# EAGLE design tinyha_pbx (EAGLE 7.7.0)
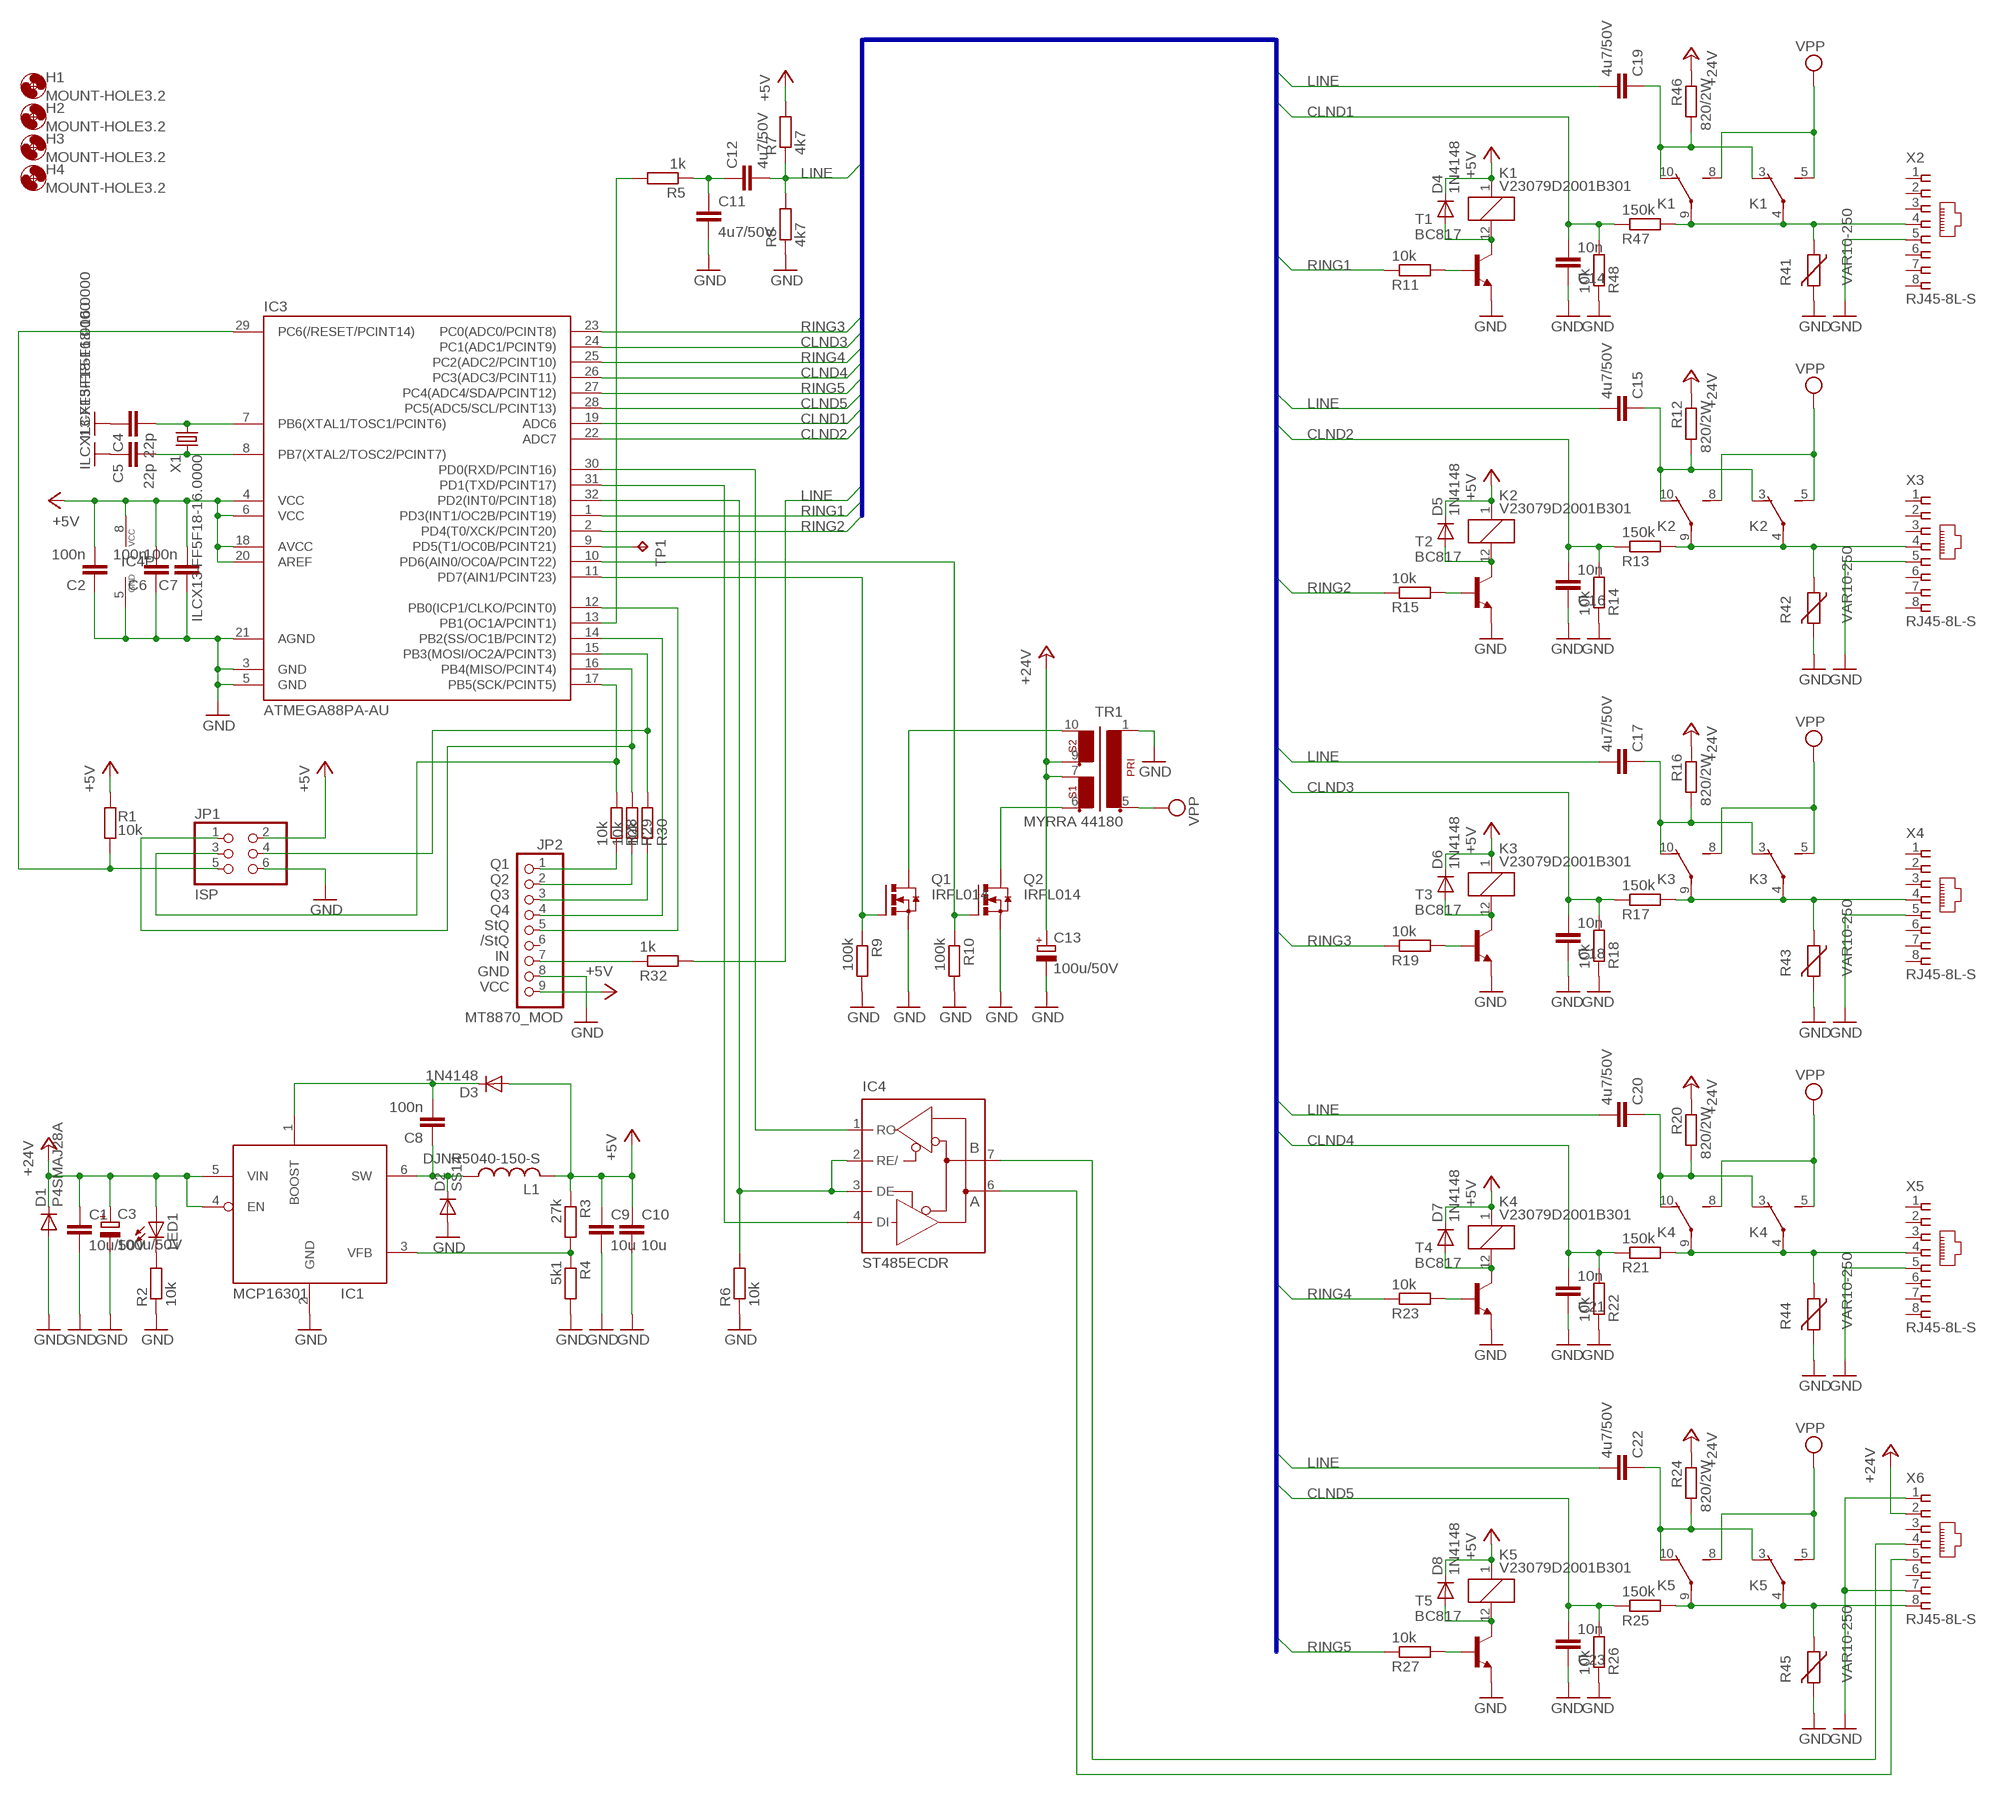
[diagram p0: schematic, sheet 1]

## Parts
C1  10u/50V  C-EUC1210K  [C1210K]
C2  100n  C-EUC1206K  [C1206K]
C3  100u/50V  CPOL-EUE3.5-8  [E3,5-8]
C4  22p  C-EUC0805K  [C0805K]
C5  22p  C-EUC0805K  [C0805K]
C6  100n  C-EUC0805K  [C0805K]
C7  100n  C-EUC0805K  [C0805K]
C8  100n  C-EUC0805K  [C0805K]
C9  10u  C-EUC0805K  [C0805K]
C10  10u  C-EUC0805K  [C0805K]
C11  4u7/50V  C-EUC1206  [C1206]
C12  4u7/50V  C-EUC1206  [C1206]
C13  100u/50V  CPOL-EUE3.5-8  [E3,5-8]
C14  10n  C-EUC1206  [C1206]
C15  4u7/50V  C-EUC1206  [C1206]
C16  10n  C-EUC1206  [C1206]
C17  4u7/50V  C-EUC1206  [C1206]
C18  10n  C-EUC1206  [C1206]
C19  4u7/50V  C-EUC1206  [C1206]
C20  4u7/50V  C-EUC1206  [C1206]
C21  10n  C-EUC1206  [C1206]
C22  4u7/50V  C-EUC1206  [C1206]
C23  10n  C-EUC1206  [C1206]
D1  P4SMAJ28A  DIODE-DO214AC  [DO214AC]
D2  SS14  DIODE-DO214AC  [DO214AC]
D3  1N4148  DIODE-MICROMELF-W  [MICROMELF-W]
D4  1N4148  DIODE-MINIMELF  [MINIMELF]
D5  1N4148  DIODE-MINIMELF  [MINIMELF]
D6  1N4148  DIODE-MINIMELF  [MINIMELF]
D7  1N4148  DIODE-MINIMELF  [MINIMELF]
D8  1N4148  DIODE-MINIMELF  [MINIMELF]
H1  MOUNT-HOLE3.2  [3,2]
H2  MOUNT-HOLE3.2  [3,2]
H3  MOUNT-HOLE3.2  [3,2]
H4  MOUNT-HOLE3.2  [3,2]
IC1  MCP16301  [SOT23-6L]
IC3  ATMEGA88PA-AU  ATMEGA48/88/168-AU  [TQFP32-08]
IC4  ST485ECDR  MAX481CSA  [SO08]
JP1  ISP  PINHD-2X3  [2X03]
JP2  MT8870_MOD  PINHD-1X9  [1X09]
K1  V23079D2001B301  [V23079D]
K2  V23079D2001B301  [V23079D]
K3  V23079D2001B301  [V23079D]
K4  V23079D2001B301  [V23079D]
K5  V23079D2001B301  [V23079D]
L1  DJNR5040-150-S  DJNR5040  [DJNR5040]
LED1  LED3MM  [LED3MM]
Q1  IRFL014  N-HEXFET-2D_SOT232-IRLL014N  [SOT223]
Q2  IRFL014  N-HEXFET-2D_SOT232-IRLL014N  [SOT223]
R1  10k  R-EU_R0805  [R0805]
R2  10k  R-EU_R1206  [R1206]
R3  27k  R-EU_R0805  [R0805]
R4  5k1  R-EU_R0805  [R0805]
R5  1k  R-EU_R1206  [R1206]
R6  10k  R-EU_R1206  [R1206]
R7  4k7  R-EU_R1206  [R1206]
R8  4k7  R-EU_R1206  [R1206]
R9  100k  R-EU_R1206  [R1206]
R10  100k  R-EU_R1206  [R1206]
R11  10k  R-EU_R1206  [R1206]
R12  820/2W  R-EU_0411/15  [0411/15]
R13  150k  R-EU_R1206  [R1206]
R14  10k  R-EU_R1206  [R1206]
R15  10k  R-EU_R1206  [R1206]
R16  820/2W  R-EU_0411/15  [0411/15]
R17  150k  R-EU_R1206  [R1206]
R18  10k  R-EU_R1206  [R1206]
R19  10k  R-EU_R1206  [R1206]
R20  820/2W  R-EU_0411/15  [0411/15]
R21  150k  R-EU_R1206  [R1206]
R22  10k  R-EU_R1206  [R1206]
R23  10k  R-EU_R1206  [R1206]
R24  820/2W  R-EU_0411/15  [0411/15]
R25  150k  R-EU_R1206  [R1206]
R26  10k  R-EU_R1206  [R1206]
R27  10k  R-EU_R1206  [R1206]
R28  10k  R-EU_R1206  [R1206]
R29  10k  R-EU_R1206  [R1206]
R30  10k  R-EU_R1206  [R1206]
R32  1k  R-EU_R1206  [R1206]
R41  VAR10-250  VARISTOR-7,5  [R-7,5]
R42  VAR10-250  VARISTOR-7,5  [R-7,5]
R43  VAR10-250  VARISTOR-7,5  [R-7,5]
R44  VAR10-250  VARISTOR-7,5  [R-7,5]
R45  VAR10-250  VARISTOR-7,5  [R-7,5]
R46  820/2W  R-EU_0411/15  [0411/15]
R47  150k  R-EU_R1206  [R1206]
R48  10k  R-EU_R1206  [R1206]
T1  BC817  BC817-25-NPN-SOT23-BEC  [SOT23-BEC]
T2  BC817  BC817-25-NPN-SOT23-BEC  [SOT23-BEC]
T3  BC817  BC817-25-NPN-SOT23-BEC  [SOT23-BEC]
T4  BC817  BC817-25-NPN-SOT23-BEC  [SOT23-BEC]
T5  BC817  BC817-25-NPN-SOT23-BEC  [SOT23-BEC]
TP1  TPB2,54  [B2,54]
TR1  MYRRA 44180  EI30-2  [EI30-2]
X1  ILCX13-FF5F18-16.0000  XTAL-3225  [SMD3225]
X2  RJ45-8L-S  [RJ45-NO-SHIELD]
X3  RJ45-8L-S  [RJ45-NO-SHIELD]
X4  RJ45-8L-S  [RJ45-NO-SHIELD]
X5  RJ45-8L-S  [RJ45-NO-SHIELD]
X6  RJ45-8L-S  [RJ45-NO-SHIELD]

## Nets
+5V: C2.2 C6.2 C7.2 C9.1 C10.1 D3.A D4.C D5.C D6.C D7.C D8.C IC3.4(VCC) IC3.6(VCC) IC3.18(AVCC) IC3.20(AREF) IC4.8(VCC) JP1.2 JP2.9 K1.1 K2.1 K3.1 K4.1 K5.1 L1.2 R1.1 R3.1 R7.2
+24V: C1.1 C3.+ C13.+ D1.C IC1.4(EN) IC1.5(VIN) LED1.A R12.1 R16.1 R20.1 R24.1 R46.1 TR1.7 TR1.9 X6.2
CLND1: C14.2 IC3.19(ADC6) R47.1 R48.2
CLND2: C16.2 IC3.22(ADC7) R13.1 R14.2
CLND3: C18.2 IC3.24(PC1(ADC1/PCINT9)) R17.1 R18.2
CLND4: C21.2 IC3.26(PC3(ADC3/PCINT11)) R21.1 R22.2
CLND5: C23.2 IC3.28(PC5(ADC5/SCL/PCINT13)) R25.1 R26.2
DIR: IC3.32(PD2(INT0/PCINT18)) IC4.2(RE/) IC4.3(DE) R6.2
GND: C1.2 C2.1 C3.- C4.1 C5.1 C6.1 C7.1 C9.2 C10.2 C11.2 C13.- C14.1 C16.1 C18.1 C21.1 C23.1 D1.A D2.A IC1.2(GND) IC3.3(GND) IC3.5(GND) IC3.21(AGND) IC4.5(GND) JP1.6 JP2.8 Q1.3(S) Q2.3(S) R2.1 R4.2 R6.1 R8.1 R9.2 R10.2 R14.1 R18.1 R22.1 R26.1 R41.2 R42.2 R43.2 R44.2 R45.2 R48.1 T1.E T2.E T3.E T4.E T5.E TR1.1 X1.2(GND) X1.4(GND) X2.5 X3.5 X4.5 X5.5 X6.1 X6.7
LINE: C12.2 C15.2 C17.2 C19.2 C20.2 C22.2 R7.1 R8.2 R32.2
MISO: IC3.16(PB4(MISO/PCINT4)) JP1.1 R29.2
MOSI: IC3.15(PB3(MOSI/OC2A/PCINT3)) JP1.4 R30.2
N$1: D4.A K1.12 T1.C
N$2: R11.2 T1.B
N$3: JP2.1 R28.1
N$4: C15.1 K2.3(O) K2.10(O) R12.2
N$5: K3.4(P) K3.9(P) R17.2 R43.1 X4.4
N$6: K5.4(P) K5.9(P) R25.2 R45.1 X6.8
N$7: K2.4(P) K2.9(P) R13.2 R42.1 X3.4
N$8: K4.4(P) K4.9(P) R21.2 R44.1 X5.4
N$9: IC3.9(PD5(T1/OC0B/PCINT21)) TP1.TP
N$10: D5.A K2.12 T2.C
N$11: R15.2 T2.B
N$12: C17.1 K3.3(O) K3.10(O) R16.2
N$13: JP2.7 R32.1
N$14: D6.A K3.12 T3.C
N$15: R19.2 T3.B
N$16: C20.1 K4.3(O) K4.10(O) R20.2
N$18: D7.A K4.12 T4.C
N$19: LED1.K(C) R2.2
N$20: R23.2 T4.B
N$21: C22.1 K5.3(O) K5.10(O) R24.2
N$23: D8.A K5.12 T5.C
N$24: R27.2 T5.B
N$26: IC3.12(PB0(ICP1/CLKO/PCINT0)) JP2.5
N$27: IC4.7(B) X6.4
N$28: JP2.2 R29.1
N$29: IC4.6(A) X6.5
N$30: JP2.3 R30.1
N$31: IC3.10(PD6(AIN0/OC0A/PCINT22)) Q2.1(G) R10.1
N$32: C11.1 C12.1 R5.1
N$33: IC3.11(PD7(AIN1/PCINT23)) Q1.1(G) R9.1
N$34: Q2.2(D) Q2.4(D) TR1.6
N$35: Q1.2(D) Q1.4(D) TR1.10
N$36: C4.2 IC3.7(PB6(XTAL1/TOSC1/PCINT6)) X1.1
N$37: IC3.14(PB2(SS/OC1B/PCINT2)) JP2.4
N$38: IC1.3(VFB) R3.2 R4.1
N$39: C8.1 D2.C IC1.6(SW) L1.1
N$40: C8.2 D3.C IC1.1(BOOST)
N$44: C5.2 IC3.8(PB7(XTAL2/TOSC2/PCINT7)) X1.3
N$45: IC3.13(PB1(OC1A/PCINT1)) R5.2
N$47: K1.4(P) K1.9(P) R41.1 R47.2 X2.4
N$48: C19.1 K1.3(O) K1.10(O) R46.2
RESET: IC3.29(PC6(/RESET/PCINT14)) JP1.5 R1.2
RING1: IC3.1(PD3(INT1/OC2B/PCINT19)) R11.1
RING2: IC3.2(PD4(T0/XCK/PCINT20)) R15.1
RING3: IC3.23(PC0(ADC0/PCINT8)) R19.1
RING4: IC3.25(PC2(ADC2/PCINT10)) R23.1
RING5: IC3.27(PC4(ADC4/SDA/PCINT12)) R27.1
RXD: IC3.30(PD0(RXD/PCINT16)) IC4.1(RO)
SCK: IC3.17(PB5(SCK/PCINT5)) JP1.3 R28.2
TXD: IC3.31(PD1(TXD/PCINT17)) IC4.4(DI)
VPP: K1.5(S) K1.8(S) K2.5(S) K2.8(S) K3.5(S) K3.8(S) K4.5(S) K4.8(S) K5.5(S) K5.8(S) TR1.5
Unconnected: JP2.6 X2.1 X2.2 X2.3 X2.6 X2.7 X2.8 X3.1 X3.2 X3.3 X3.6 X3.7 X3.8 X4.1 X4.2 X4.3 X4.6 X4.7 X4.8 X5.1 X5.2 X5.3 X5.6 X5.7 X5.8 X6.3 X6.6

## Buses
RING[1..5],CLND[1..5],LINE

## Notes on the sheet
- Q1
- Q2
- Q3
- Q4
- StQ
- /StQ
- IN
- GND
- VCC

## Library data of the parts
C1 C2 C4-C12 C14-C23 = rcl:C-EU: CAPACITOR, European symbol
C3 C13 = rcl:CPOL-EU: POLARIZED CAPACITOR, European symbol
D1-D8 = diode:DIODE-: DIODE
H1-H4 = holes:MOUNT-HOLE: MOUNTING HOLE with drill center marker
IC1 = custom:MCP16301
IC3 = atmega8:ATMEGA48/88/168
IC4 = maxim:MAX481CSA: RS485 TRANSEIVER; MF: MAXIM; MPN: MAX481CSA; OC_FARNELL: unknown; OC_NEWARK: 90C3817
JP1 = pinhead:PINHD-2X3: PIN HEADER
JP2 = pinhead:PINHD-1X9: PIN HEADER
K1-K5 = custom:V23079
L1 = custom:DJNR5040
LED1 = led:LED: LED OSRAM: - CHIPLED LG R971, LG N971, LY N971, LG Q971, LY Q971, LO R971, LY R971 LH N974, LH R974 LS Q976, LO Q976, LY Q976 LO Q996 - Hyper CHIPLED LW Q18S LB Q993, LB Q99A, LB R99A - SideLED LS A670, LO A670, LY A670, LG A670, LP A670 LB A673, LV A673, LT A673, LW A673 LH A674 LY A675 LS A676, LA A676, LO A676, LY A676, LW A676 LS A679, LY A679, LG A679 - Hyper Micro SIDELED® LS Y876, LA Y876, LO Y876, LY Y876 LT Y87S - SmartLED LW L88C, LW L88S LB L89C, LB L89S, LG L890 LS L89K, LO L89K, LY L89K LS L896, LA L896, LO L896, LY L896 - TOPLED LS T670, LO T670, LY T670, LG T670, LP T670 LSG T670, LSP T670, LSY T670, LOP T670, LYG T670 LG T671, LOG T671, LSG T671 LB T673, LV T673, LT T673, LW T673 LH T674 LS T676, LA T676, LO T676, LY T676, LB T676, LH T676, LSB T676, LW T676 LB T67C, LV T67C, LT T67C, LS T67K, LO T67K, LY T67K, LW E67C LS E67B, LA E67B, LO E67B, LY E67B, LB E67C, LV E67C, LT E67C LW T67C LS T679, LY T679, LG T679 LS T770, LO T770, LY T770, LG T770, LP T770 LB T773, LV T773, LT T773, LW T773 LH T774 LS E675, LA E675, LY E675, LS T675 LS T776, LA T776, LO T776, LY T776, LB T776 LHGB T686 LT T68C, LB T68C - Hyper Mini TOPLED® LB M676 - Mini TOPLED Santana® LG M470 LS M47K, LO M47K, LY M47K Source: http://www.osram.convergy.de LUXEON: - LUMILED® LXK2-PW12-R00, LXK2-PW12-S00, LXK2-PW14-U00, LXK2-PW14-V00 LXK2-PM12-R00, LXK2-PM12-S00, LXK2-PM14-U00 LXK2-PE12-Q00, LXK2-PE12-R00, LXK2-PE12-S00, LXK2-PE14-T00, LXK2-PE14-U00 LXK2-PB12-K00, LXK2-PB12-L00, LXK2-PB12-M00, LXK2-PB14-N00, LXK2-PB14-P00, LXK2-PB14-Q00 LXK2-PR12-L00, LXK2-PR12-M00, LXK2-PR14-Q00, LXK2-PR14-R00 LXK2-PD12-Q00, LXK2-PD12-R00, LXK2-PD12-S00 LXK2-PH12-R00, LXK2-PH12-S00 LXK2-PL12-P00, LXK2-PL12-Q00, LXK2-PL12-R00 Source: www.luxeon.com KINGBRIGHT: KA-3528ASYC Source: www.kingbright.com
Q1 Q2 = transistor-power:N-HEXFET-2D_?-*: HEXFET® Power MOSFET 2 Drain connects http://www.irf.com/product-info/datasheets/data/irll014n.pdf
R1-R30 R32 R46-R48 = rcl:R-EU_: RESISTOR, European symbol
R41-R45 = varistor:VARISTOR: VARISTOR
T1-T5 = transistor:*-NPN-: NPN Transistror BF959 corrected 2008.03.06
TP1 = testpad:TP: Test pad
TR1 = trafo:EI30-2: TRANSFORMER 1 primary winding, 2 secondary windings ERA
X1 = custom:XTAL-3225
X2-X6 = con-tycoelectronics:RJ45: CORCOM Modular RJ Jacks No Shield Source: www.tycoelectronics.com .. ENG_DS_1654001_1099_RJ_L_0507.pdf; MF: TYCO ELECTRONICS; MPN: RJ45-8L-S; OC_FARNELL: unknown; OC_NEWARK: 80K9067

## Board
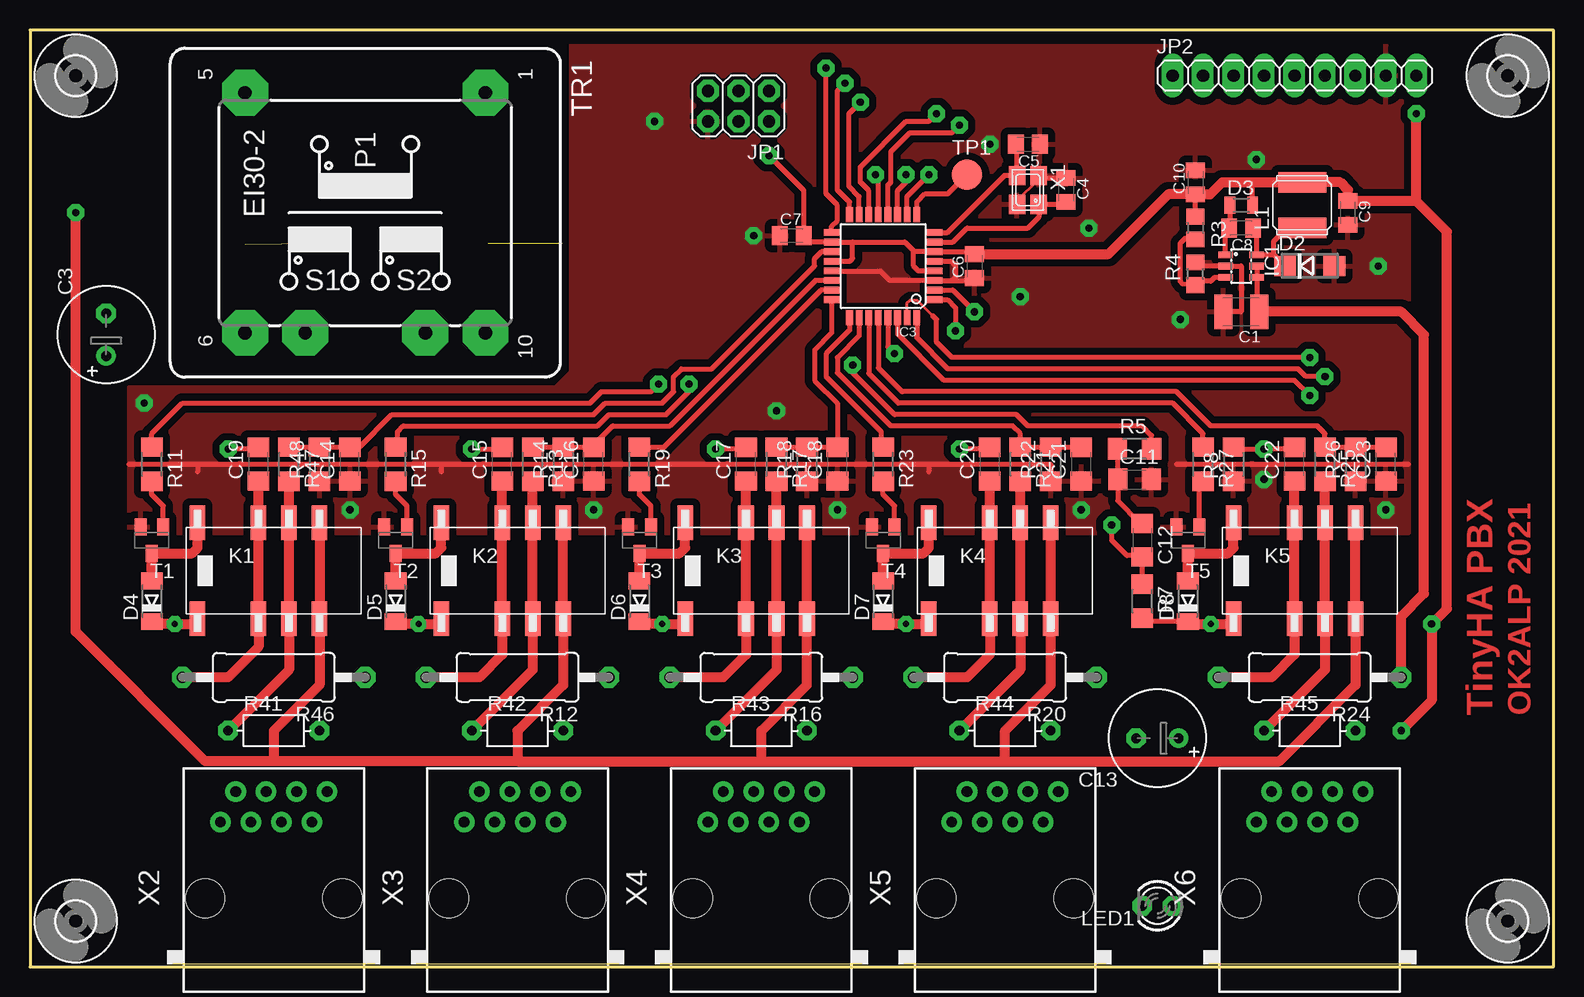
[diagram p1: board, top side]
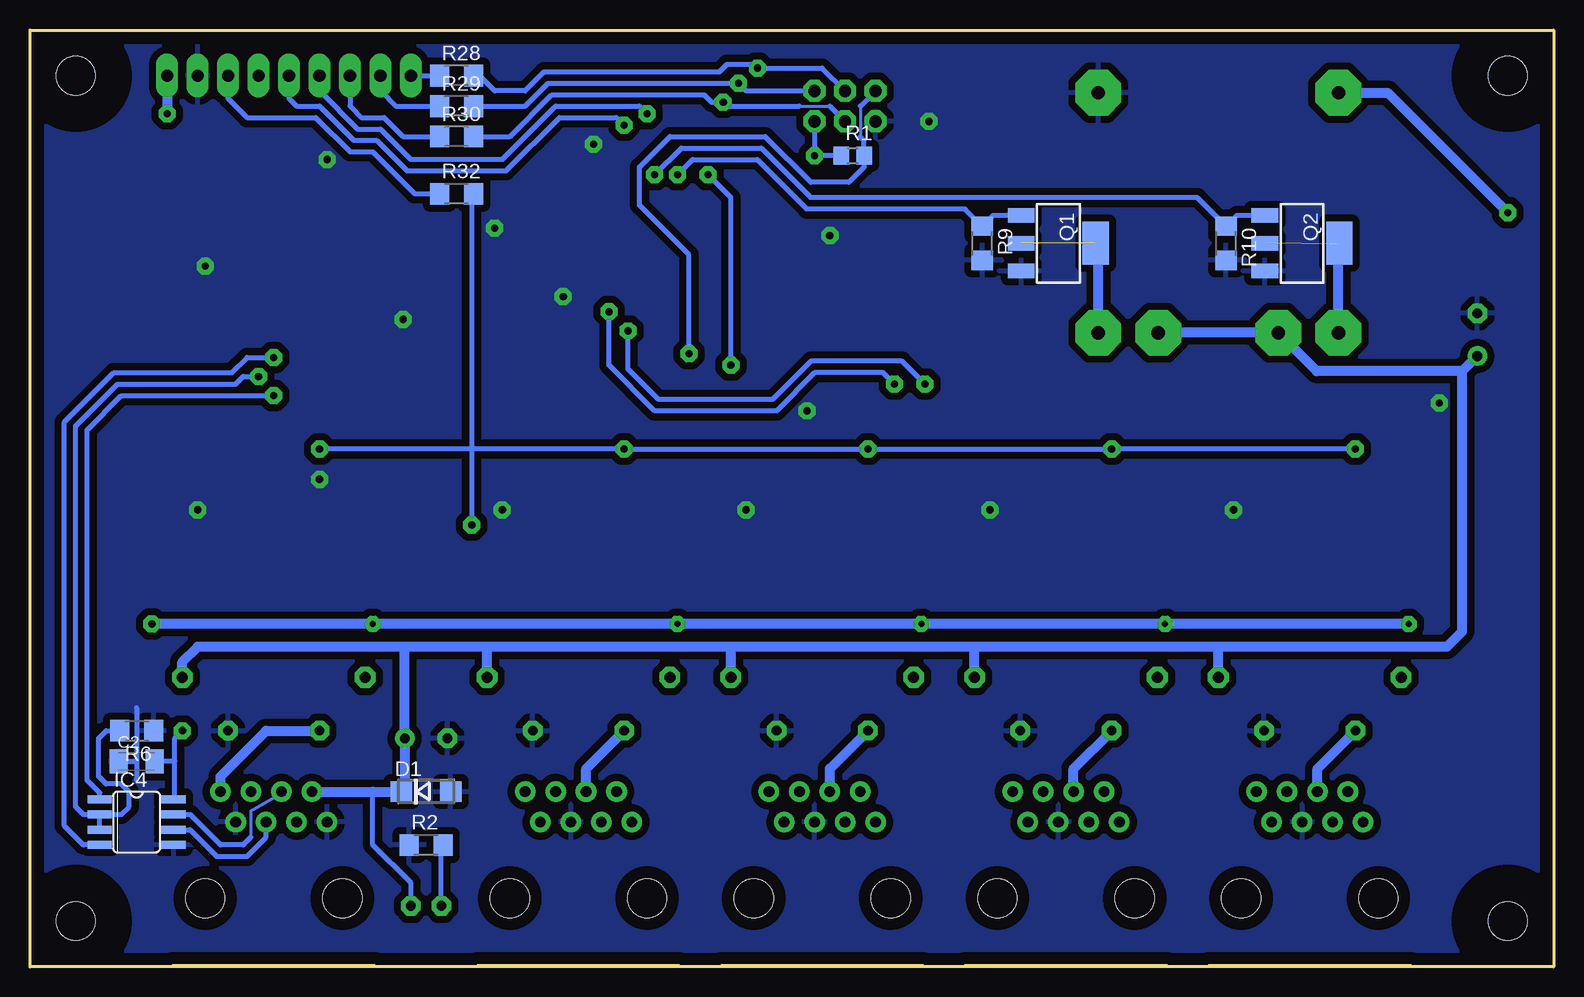
[diagram p2: board, bottom side, seen from below]

Size 127 x 78.11 mm. Coordinates in mm from the lower left corner, seen from the top.
Outline: 0,0 127,0 127,78.11 0,78.11 0,0
Copper layers (1*16): Top 0.035mm / dielectric 1.5mm / Bottom 0.035mm
Design rules "default *": minimum track width 10mil, minimum drill 0.5mm, track to track 8mil, track to pad 8mil, pad to pad 8mil, via to via 8mil, smd to smd 8mil, copper to edge 40mil, drill to drill 8mil, minimum pad ring 16mil, minimum via ring 16mil, stop-mask expansion 4mil, vias tented up to drill 0mil, thermal gap 24mil

### Footprints (pad centres in the part's own frame; a part is rotated, then mirrored left to right if it is on the bottom)
C1210K = smd 1.5 x 2.9: 1 -1.5,0; 2 1.5,0
C1206K = smd 1.5 x 2: 1 -1.5,0; 2 1.5,0
E3,5-8 = drill 0.813 pad 1.6: + -1.778,0 | drill 0.813 pad 1.6 octagon: - 1.778,0
C0805K = smd 1.3 x 1.6: 1 -1,0; 2 1,0
C1206 = smd 1.6 x 1.8: 1 -1.4,0; 2 1.4,0
DO214AC = smd 1.8 x 1.7: A 2.05,0; C -2.05,0
MICROMELF-W = smd 0.9 x 1.4: A 0.95,0; C -0.95,0
MINIMELF = smd 1.4 x 1.8: A 1.7,0; C -1.7,0
3,2 = hole 3.2: 0,0
SOT23-6L = smd 0.55 x 1.2: 1 -0.95,-1.3; 2 0,-1.3; 3 0.95,-1.3; 4 0.95,1.3; 5 0,1.3; 6 -0.95,1.3
TQFP32-08 = smd 1.27 x 0.559: 1 -4.293,2.8; 2 -4.293,2; 3 -4.293,1.2; 4 -4.293,0.4; 5 -4.293,-0.4; 6 -4.293,-1.2; 7 -4.293,-2; 8 -4.293,-2.8; 17 4.293,-2.8; 18 4.293,-2; 19 4.293,-1.2; 20 4.293,-0.4; 21 4.293,0.4; 22 4.293,1.2; 23 4.293,2; 24 4.293,2.8 | smd 0.559 x 1.27: 9 -2.8,-4.293; 10 -2,-4.293; 11 -1.2,-4.293; 12 -0.4,-4.293; 13 0.4,-4.293; 14 1.2,-4.293; 15 2,-4.293; 16 2.8,-4.293; 25 2.8,4.293; 26 2,4.293; 27 1.2,4.293; 28 0.4,4.293; 29 -0.4,4.293; 30 -1.2,4.293; 31 -2,4.293; 32 -2.8,4.293
SO08 = smd 0.66 x 2.032: 1 -1.905,-3.073; 2 -0.635,-3.073; 3 0.635,-3.073; 4 1.905,-3.073; 5 1.905,3.073; 6 0.635,3.073; 7 -0.635,3.073; 8 -1.905,3.073
2X03 = drill 1.016 octagon: 1 -2.54,-1.27; 2 -2.54,1.27; 3 0,-1.27; 4 0,1.27; 5 2.54,-1.27; 6 2.54,1.27
1X09 = drill 1.016 long: 1 -10.16,0; 2 -7.62,0; 3 -5.08,0; 4 -2.54,0; 5 0,0; 6 2.54,0; 7 5.08,0; 8 7.62,0; 9 10.16,0
V23079D = smd 1.3 x 2.85: 1 -6.35,-4; 3 -1.27,-4; 4 1.27,-4; 5 3.81,-4; 8 3.81,4; 9 1.27,4; 10 -1.27,4; 12 -6.35,4
DJNR5040 = smd 1.7 x 4: 1 -1.9,0; 2 1.9,0
LED3MM = drill 0.813 octagon: A -1.27,0; K 1.27,0
SOT223 = smd 1.219 x 2.235: 1 -2.311,-3.099; 2 0,-3.099; 3 2.311,-3.099 | smd 3.6 x 2.2: 4 0,3.099
R0805 = smd 1.3 x 1.5: 1 -0.95,0; 2 0.95,0
R1206 = smd 1.6 x 1.803: 1 -1.422,0; 2 1.422,0
0411/15 = drill 0.914 octagon: 1 -7.62,0; 2 7.62,0
R-7,5 = drill 0.813 octagon: 1 -3.81,0; 2 3.81,0
SOT23-BEC = smd 1 x 1.4: B -0.95,-1.1; C 0,1.1; E 0.95,-1.1
B2,54 = smd 2.54 x 2.54: TP 0,0
EI30-2 = drill 1.118 pad 3.81 octagon: 1 -10.008,10.008; 5 -10.008,-10.008; 6 10.008,-10.008; 7 10.008,-5.004; 9 10.008,5.004; 10 10.008,10.008
SMD3225 = smd 1.6 x 1.35: 1 1.2,0.9; 2 -1.2,0.9; 3 -1.2,-0.9; 4 1.2,-0.9
RJ45-NO-SHIELD = drill 0.9 pad 1.4: 1 -4.445,6.35; 2 -3.175,8.89; 3 -1.905,6.35; 4 -0.635,8.89; 5 0.635,6.35; 6 1.905,8.89; 7 3.175,6.35; 8 4.445,8.89 | hole 3.251: -5.715,0; 5.715,0

### Placement (x,y rotation side)
C1  100.97,54.61 180 top
C2  118.11,17.14 0 bottom
C3  6.35,52.7 90 top
C4  86.36,64.77 270 top
C5  83.19,68.58 180 top
C6  78.74,58.42 90 top
C7  63.5,60.96 0 top
C8  100.97,61.59 180 top
C9  109.86,62.87 270 top
C10  97.16,65.41 90 top
C11  92.08,40.64 0 top
C12  92.71,35.56 270 top
C13  93.98,19.05 180 top
C14  26.67,41.91 90 top
C15  39.37,41.91 90 top
C16  46.99,41.91 90 top
C17  59.69,41.91 90 top
C18  67.31,41.91 90 top
C19  19.05,41.91 90 top
C20  80.01,41.91 90 top
C21  87.63,41.91 90 top
C22  105.41,41.91 90 top
C23  113.03,41.91 90 top
D1  93.98,14.61 0 bottom
D2  106.68,58.42 0 top
D3  100.97,63.5 0 top
D4  10.16,30.48 90 top
D5  30.48,30.48 90 top
D6  50.8,30.48 90 top
D7  71.12,30.48 90 top
D8  96.52,30.48 90 top
H1  3.81,3.81 0 top
H2  123.19,3.81 0 top
H3  3.81,74.3 0 top
H4  123.19,74.3 0 top
IC1  100.97,58.42 270 top
IC3  71.12,58.42 180 top
IC4  118.11,12.06 270 bottom
JP1  59.05,71.75 180 top
JP2  105.41,74.3 0 top
K1  20.32,33.02 0 top
K2  40.64,33.02 0 top
K3  60.96,33.02 0 top
K4  81.28,33.02 0 top
K5  106.68,33.02 0 top
L1  106.05,63.5 90 top
LED1  93.98,5.08 180 top
Q1  41.27,60.33 270 bottom
Q2  20.95,60.33 270 bottom
R1  58.42,67.63 0 bottom
R2  93.98,10.16 0 bottom
R3  97.16,61.59 270 top
R4  97.16,57.78 90 top
R5  92.08,43.18 0 top
R6  118.11,19.68 180 bottom
R7  92.71,30.48 270 top
R8  100.33,41.91 90 top
R9  47.62,60.33 270 bottom
R10  27.3,60.33 270 bottom
R11  10.16,41.91 270 top
R12  40.64,24.13 180 top
R13  41.91,41.91 270 top
R14  44.45,41.91 90 top
R15  30.48,41.91 270 top
R16  60.96,24.13 180 top
R17  62.23,41.91 270 top
R18  64.77,41.91 90 top
R19  50.8,41.91 270 top
R20  81.28,24.13 180 top
R21  82.55,41.91 270 top
R22  85.09,41.91 90 top
R23  71.12,41.91 270 top
R24  106.68,24.13 180 top
R25  107.95,41.91 270 top
R26  110.49,41.91 90 top
R27  97.79,41.91 270 top
R28  91.44,74.3 0 bottom
R29  91.44,71.75 0 bottom
R30  91.44,69.22 0 bottom
R32  91.44,64.45 0 bottom
R41  20.32,19.68 0 top
R42  40.64,19.68 0 top
R43  60.96,19.68 0 top
R44  81.28,19.68 0 top
R45  106.68,19.68 0 top
R46  20.32,24.13 180 top
R47  21.59,41.91 270 top
R48  24.13,41.91 90 top
T1  10.16,35.56 180 top
T2  30.48,35.56 180 top
T3  50.8,35.56 180 top
T4  71.12,35.56 180 top
T5  96.52,35.56 180 top
TP1  78.11,66.04 0 top
TR1  27.94,62.87 270 top
X1  83.19,64.77 270 top
X2  20.32,5.71 0 top
X3  40.64,5.71 0 top
X4  60.96,5.71 0 top
X5  81.28,5.71 0 top
X6  106.68,5.71 0 top

### Tracks (layer width: path | path; a pad name or v marks a point on that pad's centre or on a via)
+5V  (via drill 0.5, 0.6)
  Top 0.406: D3.A 101.92,65.08 102.23,65.41 | D8.C 92.99,28.78 R7.2 | IC3.4 74.06,58.02 73.66,58.42 73.66,59.69 | 68.58,60.42 IC3.18 65.04,60.42 C7.2 64.5,64.72 v61.59,67.63 | 68.58,60.42 72.93,60.42 73.66,59.69 | 73.66,59.69 73.73,59.62 IC3.6 78.54,59.62 C6.2 | R3.1 C10.1 | IC3.20 68.34,58.82 68.58,59.05 68.58,60.42
  Top 0.813: D8.C 96.52,28.57 v98.42,28.57 99.89,28.57 K5.1 | D7.C 71.33,28.57 v73.03,28.57 74.48,28.57 K4.1 | D6.C 51.01,28.57 v52.7,28.57 54.61,28.57 K3.1 | D5.C 30.68,28.57 v32.38,28.57 33.84,28.57 K2.1 | D4.C 10.37,28.57 v12.06,28.57 13.53,28.57 K1.1 | v114.3,19.68 116.84,22.23 v116.84,28.57 118.11,29.84 118.11,61.28 115.57,63.82 | 115.57,63.82 v115.57,71.12 | C6.2 89.9,59.42 94.89,64.41 C10.1 98.38,64.41 99.38,65.41 102.23,65.41 L1.2 109.22,65.41 109.86,64.77 C9.1 109.9,63.82 115.57,63.82
  Bottom 0.406: 114.94,17.14 C2.2 | IC4.8 114.94,13.97 114.94,17.14 | 114.94,17.14 114.94,19.05 v114.3,19.68 | 61.59,69.22 JP1.2 v61.59,67.63 R1.1
  Bottom 0.813: v12.06,28.57 v32.38,28.57 v52.7,28.57 v73.03,28.57 v98.42,28.57 v116.84,28.57 | JP2.9 v115.57,71.12
+24V
  Top 0.406: IC1.5 IC1.4 102.27,54.98 C1.1
  Top 0.813: R24.1 114.3,29.21 116.2,31.11 116.2,52.7 114.3,54.61 C1.1
  Bottom 0.406: LED1.A 95.25,6.99 98.42,10.16 98.42,14.61
  Bottom 0.813: 27.94,26.67 8.89,26.67 7.62,27.94 7.62,49.66 | 27.94,26.67 48.26,26.67 | 48.26,26.67 68.58,26.67 | 68.58,26.67 88.9,26.67 | TR1.9 TR1.7 19.74,49.66 7.62,49.66 | 88.9,26.67 95.89,26.67 | 95.89,26.67 113.03,26.67 114.3,25.4 R24.1 | R46.1 27.94,26.67 | R12.1 48.26,26.67 | R16.1 68.58,26.67 | R20.1 88.9,26.67 | X6.2 98.42,14.61 D1.C | D1.C 95.89,14.61 | 7.62,49.66 C3.+ | D1.C 95.76,14.88 C13.+ 95.76,26.54 95.89,26.67
CLND1
  Top 0.406: R47.1 R48.2 26.65,43.33 C14.2 27.43,43.31 30.16,46.04 46.99,46.04 47.94,46.99 52.7,46.99 53.66,47.94 53.66,49.21 54.29,49.85 56.83,49.85 65.41,58.42 65.41,59.05 65.97,59.62 IC3.19
CLND2
  Top 0.406: R13.1 R14.2 47.01,43.33 | 47.62,43.18 47.47,43.33 47.01,43.33 | IC3.22 65.47,57.22 53.34,45.09 48.58,45.09 46.99,43.5 C16.2 47.01,43.33
CLND3
  Top 0.406: R17.1 R18.2 67.29,43.33 C18.2 67.31,46.99 65.41,48.9 65.41,51.44 66.83,52.86 IC3.24
CLND4
  Top 0.406: C21.2 87.61,43.33 R22.2 R21.1 82.55,44.45 81.92,45.09 71.75,45.09 67.31,49.53 67.31,50.8 69.12,52.61 IC3.26
CLND5
  Top 0.406: C23.2 113.01,43.33 R26.2 R25.1 107.95,44.45 107.31,45.09 98.42,45.09 95.57,47.94 72.71,47.94 70.72,49.93 IC3.28
DIR  (via drill 0.6)
  Top 0.406: v107.95,49.21 106.36,49.21 105.73,49.85 76.52,49.85 73.92,52.45 IC3.32
  Bottom 0.406: IC4.3 IC4.2 | IC4.2 122.56,12.7 123.19,13.34 123.19,45.09 119.7,48.58 109.86,48.58 109.22,49.21 v107.95,49.21 | IC4.2 119.38,12.7 118.75,13.34 118.75,14.61 119.38,15.24 120.65,15.24 121.28,15.88 121.28,19.05 120.65,19.68 R6.2
GND  (via drill 0.6)
  Top 0.254: X1.4 82.28,63.87 84.08,65.67 X1.2
  Top 0.406: R4.2 97.37,58.42 IC1.2 100.97,58.42 100.97,54.61 C1.2 | IC3.21 70.89,58.02 71.69,57.22 IC3.3 76.83,57.22 | IC3.5 76.75,58.82 77.15,58.42 77.15,57.54 76.83,57.22 | 8.26,41.91 13.97,41.91 | 13.97,41.91 34.29,41.91 | 34.29,41.91 74.93,41.91 | 74.93,41.91 85.09,41.91 85.09,40.64 | 95.57,41.91 114.94,41.91 | 74.93,41.91 74.93,41.27 | 34.29,41.91 34.29,41.27 | 13.97,41.91 13.97,41.27 | C4.1 84.28,65.77 X1.2 | 76.83,57.22 78.54,57.22 C6.1
  Bottom 0.406: 118.11,21.59 118.11,17.14 | 118.11,17.14 118.11,15.56 | C2.1 118.11,17.14
  other vias: 26.67,38.1 46.99,38.1 67.31,38.1 87.63,38.1 102.87,40.64 113.03,38.1 9.53,46.99 112.39,58.42 95.89,53.98 102.23,67.31 80.01,68.58 60.33,60.96 82.55,55.88 62.23,46.35 52.07,70.48 88.27,61.59
  pour Bottom (isolate 0.61): 0,0 127,0 127,78.11 0,78.11
  pour Top (isolate 0.61): 8.26,36.2 114.94,36.2 114.94,78.11 45.09,78.11 45.09,49.53 43.81,48.26 8.26,48.26
LINE  (via drill 0.6)
  Top 0.406: C19.2 19.05,43.18 v16.51,43.18 | v36.83,43.18 39.24,43.18 C15.2 | C17.2 59.69,43.18 v57.15,43.18 | C20.2 80.01,43.18 v77.47,43.18 | C22.2 105.41,43.18 v102.87,43.18 100.33,43.18 R8.2 | R7.1 C12.2 92.71,34.29 91.44,34.29 90.17,35.56 v90.17,36.83
  Bottom 0.406: v16.51,43.18 v36.83,43.18 v57.15,43.18 v77.47,43.18 90.17,43.18 | 90.17,43.18 v90.17,36.83 | 90.17,43.18 v102.87,43.18 | 90.17,43.18 90.17,64.3 R32.2
MISO  (via drill 0.6)
  Top 0.406: IC3.16 68.32,63.76 67.31,64.77 67.31,73.03 v67.94,73.66
  Bottom 0.406: R29.2 85.72,71.75 83.82,73.66 v67.94,73.66 67.31,73.03 JP1.1
MOSI  (via drill 0.6)
  Top 0.406: IC3.15 69.12,64.23 68.26,65.09 68.26,71.12 v69.22,72.07
  Bottom 0.254: 62.87,71.75 60.33,71.75
  Bottom 0.406: R30.2 87,69.22 83.5,72.71 70.8,72.71 70.17,72.07 v69.22,72.07 68.9,71.75 62.87,71.75 | 60.33,71.75 JP1.4
N$1
  Top 0.813: K1.12 13.97,34.92 13.51,34.46 T1.C D4.A
N$2
  Top 0.406: T1.B 11.11,38.42 10.16,39.37 R11.2
N$3
  Bottom 0.406: JP2.1 R28.1
N$4
  Top 0.813: R12.2 37.47,24.13 39.37,26.04 K2.3 K2.10 C15.1
N$5
  Top 0.813: R43.1 62.23,24.77 K3.4 K3.9 R17.2
  Bottom 0.813: X4.4 60.33,16.51 R43.1
N$6
  Top 0.813: R45.1 107.95,24.77 K5.4 K5.9 R25.2
  Bottom 0.813: X6.8 111.12,15.88 107.31,19.68 R45.1
N$7
  Top 0.813: R42.1 41.91,24.77 K2.4 K2.9 R13.2
  Bottom 0.813: X3.4 40.01,16.51 R42.1
N$8
  Top 0.813: R44.1 82.55,24.77 K4.4 K4.9 R21.2
  Bottom 0.813: X5.4 80.64,16.51 R44.1
N$9
  Top 0.406: IC3.9 73.92,63.76 74.61,64.45 76.52,64.45 TP1.TP
N$10
  Top 0.813: D5.A T2.C 33.83,34.46 34.29,34.92 K2.12
N$11
  Top 0.406: T2.B 31.43,38.42 30.48,39.37 R15.2
N$12
  Top 0.813: R16.2 57.78,24.13 59.69,26.04 K3.3 K3.10 C17.1
N$13
  Bottom 0.406: JP2.7 110.49,72.39 108.9,70.8 103.19,70.8 100.33,67.94 98.42,67.94 94.93,64.45 R32.1
N$14
  Top 0.813: D6.A T3.C 54.15,34.46 54.61,34.92 K3.12
N$15
  Top 0.406: T3.B 51.75,38.42 50.8,39.37 R19.2
N$16
  Top 0.813: R20.2 78.11,24.13 80.01,26.04 K4.3 K4.10 C20.1
N$17  (via drill 0.6)
  other vias: 14.61,5.71
N$18
  Top 0.813: K4.12 74.93,34.92 74.47,34.46 T4.C D7.A
N$19
  Bottom 0.406: LED1.K 92.71,10.01 R2.2
N$20
  Top 0.406: T4.B 72.07,38.42 71.12,39.37 R23.2
N$21
  Top 0.813: R24.2 103.5,24.13 105.41,26.04 K5.3 K5.10 C22.1
N$22  (via drill 0.6)
  other vias: 26.04,5.71
N$23
  Top 0.813: K5.12 100.33,34.92 99.86,34.46 T5.C D8.A
N$24
  Top 0.406: T5.B 97.47,40.17 R27.2
N$25  (via drill 0.6)
  other vias: 34.92,5.71
N$26  (via drill 0.6)
  Top 0.406: IC3.12 71.52,65.17 71.75,65.41 71.75,67.94 73.34,69.53 76.83,69.53 v77.47,70.17
  Bottom 0.406: JP2.5 105.41,72.39 104.78,71.75 102.87,71.75 100.01,68.9 98.11,68.9 95.57,66.36 87.31,66.36 82.87,70.8 78.11,70.8 v77.47,70.17
N$27
  Bottom 0.254: 108.58,10.79 108.58,13.02 106.36,14.29 X6.4
  Bottom 0.406: 108.58,10.79 109.22,10.16 111.12,10.16 113.67,12.7 IC4.7
N$28
  Bottom 0.406: JP2.2 97.79,73.03 96.52,71.75 R29.1
N$29
  Bottom 0.406: IC4.6 113.67,11.43 111.44,9.21 108.9,9.21 107.31,10.79 X6.5
N$30
  Bottom 0.406: JP2.3 100.33,71.75 99.38,70.8 97.47,70.8 95.89,69.22 R30.1
N$31  (via drill 0.6)
  Top 0.406: IC3.10 73.12,64.23 v74.93,66.04
  Bottom 0.406: Q2.1 26.42,62.64 R10.1 | R10.1 27.46,61.75 | v74.93,66.04 72.71,68.26 66.04,68.26 61.91,64.14 29.69,64.14 R10.1
N$32
  Top 0.406: R5.1 90.67,43.16 C11.1 90.67,38.87 92.58,36.96 C12.1
N$33  (via drill 0.6)
  Top 0.406: IC3.11 72.32,64.7 73.03,65.41 v73.03,66.04
  Bottom 0.406: Q1.1 46.74,62.64 R9.1 49.06,63.18 62.23,63.18 66.36,67.31 71.75,67.31 v73.03,66.04
N$34  (1 unrouted)
  Bottom 0.813: TR1.6 17.93,60.25 Q2.4
N$35  (1 unrouted)
  Bottom 0.813: TR1.10 37.95,60.1 Q1.4
N$36
  Top 0.406: C4.2 86.16,63.57 X1.1 84.08,62.49 83.19,61.59 78.11,61.59 76.93,60.42 IC3.7
N$37  (via drill 0.6)
  Top 0.406: IC3.14 69.92,64.7 69.22,65.41 69.22,66.67 73.03,70.48 74.93,70.48 v75.56,71.12
  Bottom 0.406: JP2.4 102.87,73.03 99.69,69.85 97.79,69.85 95.25,67.31 87.63,67.31 83.19,71.75 76.2,71.75 v75.56,71.12
N$38
  Top 0.406: IC1.3 98.75,57.47 98.42,57.15 97.37,57.15 R4.1 96.1,56.94 95.89,57.15 95.89,60.33 96.31,60.74 R3.2
N$39
  Top 0.406: C8.1 102.27,61.3 IC1.6 103.68,59.37 | 103.68,59.37 D2.C | 103.68,59.37 103.68,60.5 104.78,61.59 L1.1
N$40
  Top 0.406: IC1.1 99.67,61.3 C8.2 100.02,61.65 D3.C
N$41  (via drill 0.6)
  other vias: 46.35,5.71
N$42  (via drill 0.6)
  other vias: 55.24,5.71
N$43  (via drill 0.6)
  other vias: 66.67,5.71
N$44
  Top 0.406: C5.2 82.28,68.48 X1.3 81.21,65.97 76.46,61.22 IC3.8
N$45  (via drill 0.6)
  Top 0.406: R5.2 93.5,44.3 92.71,45.09 83.19,45.09 82.23,46.04 72.07,46.04 68.58,49.53 v68.58,50.16 | IC3.13 70.72,65.81 v70.48,66.04
  Bottom 0.406: v68.58,50.16 68.58,64.14 v70.48,66.04
N$46  (via drill 0.6)
  other vias: 75.56,5.71
N$47
  Top 0.813: R41.1 21.59,24.77 K1.4 K1.9 R47.2
  Bottom 0.813: X2.4 19.68,16.51 R41.1
N$48
  Top 0.813: R46.2 16.51,24.13 19.05,26.67 K1.3 K1.10 C19.1
N$49  (via drill 0.6)
  other vias: 87,5.71
N$50  (via drill 0.6)
  other vias: 100.97,5.71
N$51  (via drill 0.6)
  other vias: 112.39,5.71
N$52  (via drill 0.6)
  other vias: 3.81,3.81
N$53  (via drill 0.6)
  other vias: 123.19,3.81
N$54  (via drill 0.6)
  other vias: 123.19,74.3
N$55  (via drill 0.6)
  other vias: 3.81,74.3
RESET  (via drill 0.6)
  Top 0.406: IC3.29 71.52,51.67 v72.07,51.12
  Bottom 0.254: 57.78,71.75 57.78,69.22
  Bottom 0.406: v72.07,51.12 72.07,59.37 76.2,63.5 76.2,66.67 73.66,69.22 65.72,69.22 61.91,65.41 58.74,65.41 57.47,66.67 R1.2 57.47,68.89 57.78,69.22 | JP1.5 57.78,71.75
RING1  (via drill 0.6)
  Top 0.406: R11.1 10.16,44.45 12.7,46.99 46.67,46.99 47.62,47.94 51.75,47.94 v52.39,48.58 | IC3.1 76.46,55.62 77.15,54.93 v77.15,53.02
  Bottom 0.406: v52.39,48.58 54.29,50.48 61.91,50.48 65.09,47.31 74.61,47.31 77.15,49.85 v77.15,53.02
RING2  (via drill 0.6)
  Top 0.406: R15.1 30.63,43.33 30.63,44.6 31.11,45.09 47.31,45.09 48.26,46.04 53.02,46.04 54.93,47.94 v54.93,48.58 | IC3.2 76.93,56.42 v78.74,54.61
  Bottom 0.406: v54.93,48.58 55.88,49.53 61.59,49.53 64.77,46.35 74.93,46.35 78.74,50.16 v78.74,54.61
RING3
  Top 0.406: IC3.23 65.94,56.42 52.86,43.33 R19.1
RING4
  Top 0.406: R23.1 70.97,43.33 70.97,44.6 66.36,49.21 66.36,51.12 68.32,53.08 IC3.25
RING5
  Top 0.406: R27.1 97.79,44.45 95.25,46.99 72.39,46.99 69.92,49.46 IC3.27
RXD  (via drill 0.6)
  Top 0.406: v106.68,47.62 105.41,48.9 76.2,48.9 72.32,52.77 IC3.30
  Bottom 0.406: v106.68,47.62 119.38,47.62 122.24,44.77 122.24,15.56 121.18,14.5 IC4.1
SCK  (via drill 0.6)
  Top 0.406: IC3.17 66.83,61.75 67.31,62.23 67.31,63.5 66.36,64.45 v66.36,74.93
  Bottom 0.406: JP1.3 60.96,74.93 v66.36,74.93 66.67,75.25 68.9,75.25 69.53,74.61 84.14,74.61 85.72,73.03 88.27,73.03 89.53,74.3 R28.2
TXD  (via drill 0.6)
  Top 0.254: 75.25,54.29 73.98,55.56 73.34,55.56 73.12,55.34 IC3.31
  Top 0.406: v106.68,50.8 76.83,50.8 75.56,52.07 75.56,53.98 75.25,54.29
  Bottom 0.406: IC4.4 122.56,10.16 124.14,11.75 124.14,45.4 120.02,49.53 110.17,49.53 108.9,50.8 v106.68,50.8
VPP  (via drill 0.6)
  Top 0.813: K2.8 K2.5 44.45,23.5 40.64,19.68 40.64,17.14 | K3.8 K3.5 64.77,23.5 60.96,19.68 60.96,17.14 | K4.8 K4.5 85.09,23.5 81.28,19.68 81.28,17.14 | K5.8 K5.5 110.49,23.5 104.14,17.14 81.28,17.14 | 40.64,17.14 60.96,17.14 | 60.96,17.14 81.28,17.14 | K1.8 K1.5 24.13,23.5 20.32,19.68 20.32,17.14 | 40.64,17.14 20.32,17.14 | 20.32,17.14 14.61,17.14 3.81,27.94 v3.81,62.87
  Bottom 0.813: TR1.5 13.82,72.87 v3.81,62.87

### Text on the board
Top: TinyHA PBX | OK2ALP 2021